# EAGLE design F767ZI NEW (EAGLE 9.6.2)
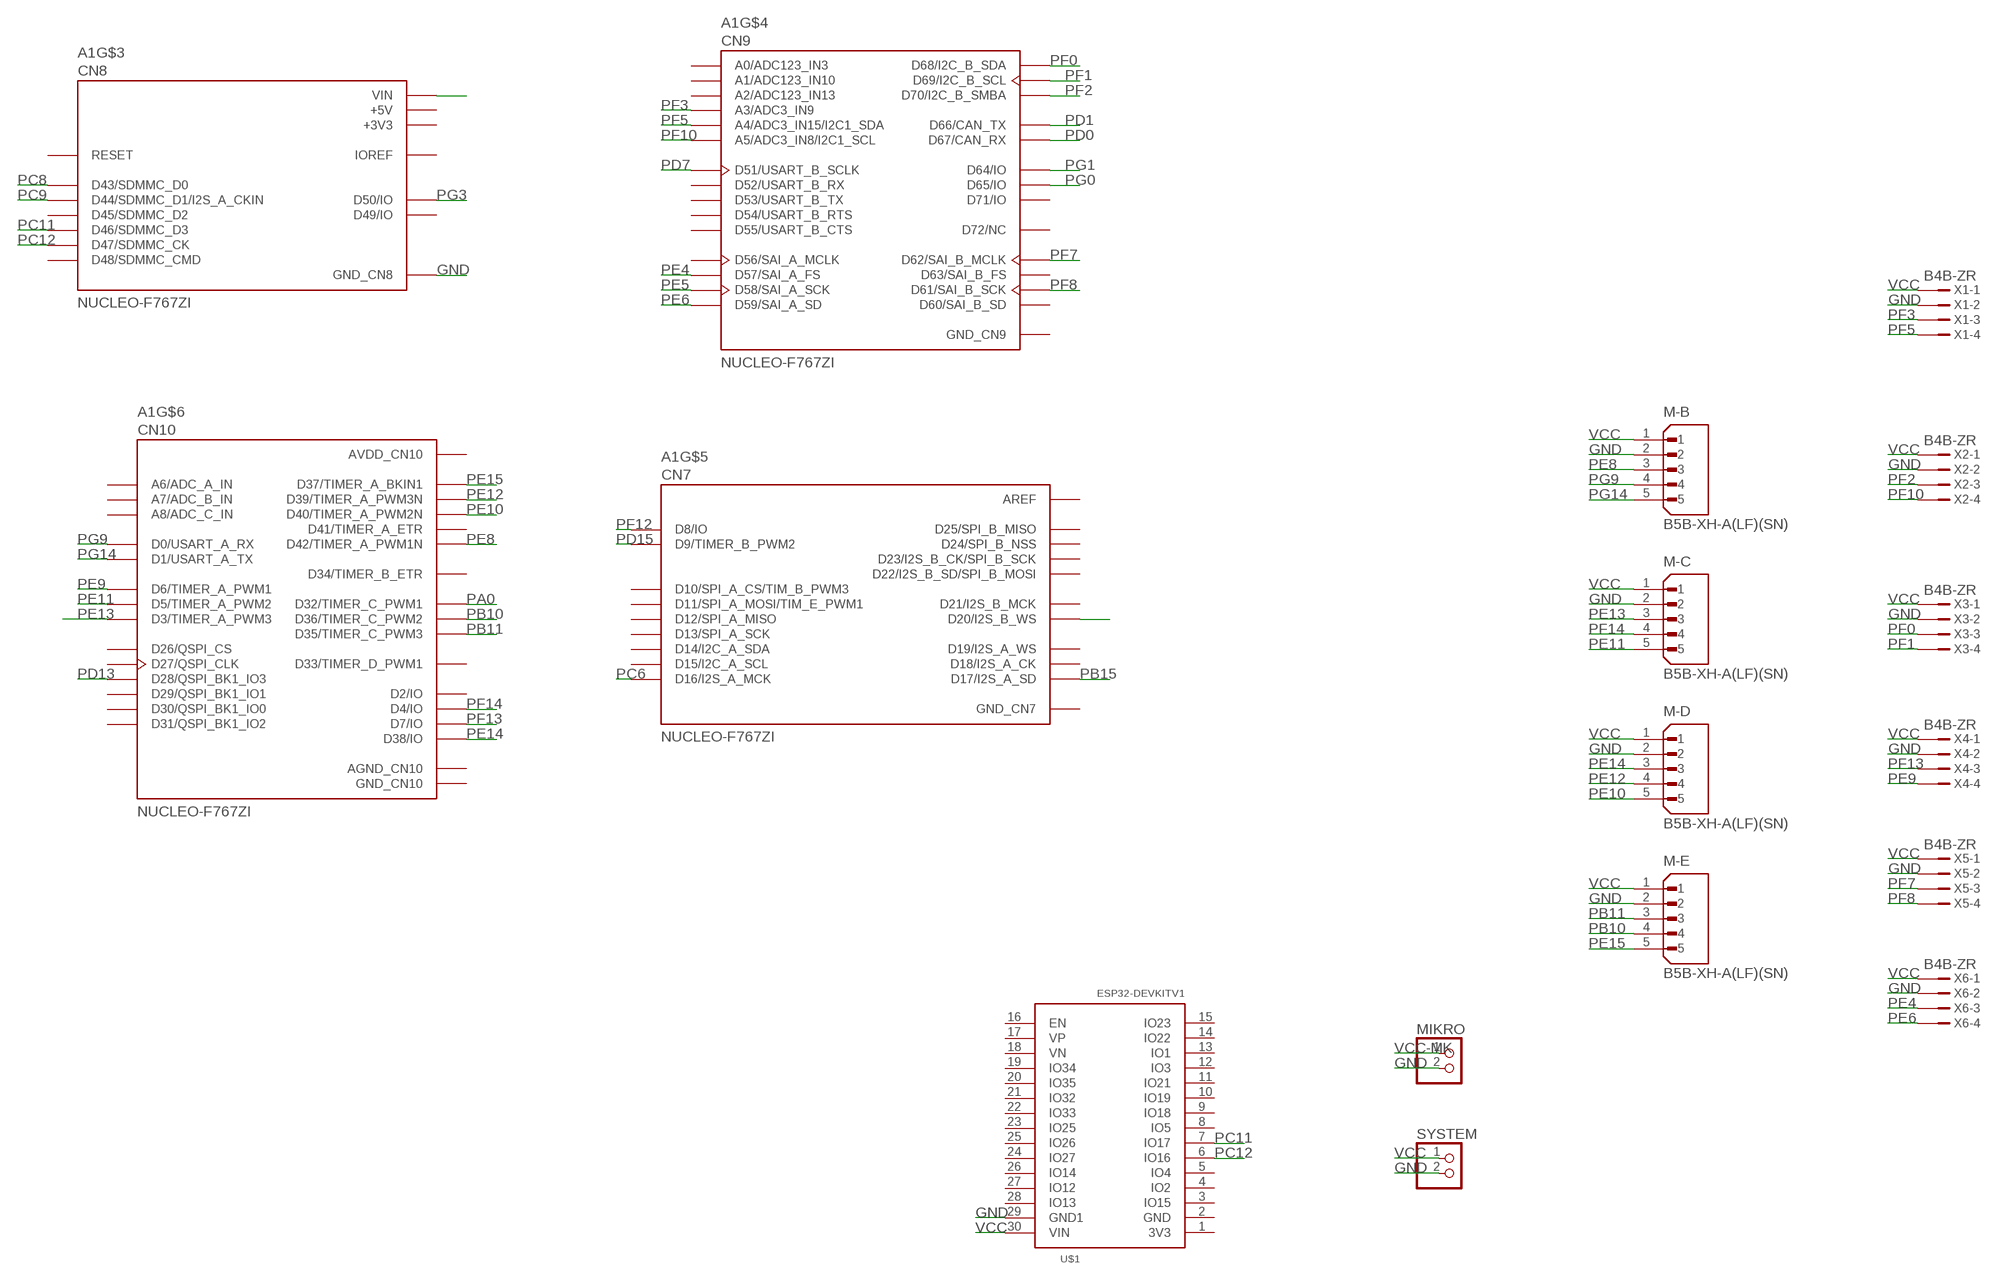
[diagram p0: schematic, sheet 1]

## Parts
A1  NUCLEO-F767ZI  [ST_NUCLEO-F767ZI]
M-B  B5B-XH-A(LF)(SN)  [JST_B5B-XH-A(LF)(SN)]
M-C  B5B-XH-A(LF)(SN)  [JST_B5B-XH-A(LF)(SN)]
M-D  B5B-XH-A(LF)(SN)  [JST_B5B-XH-A(LF)(SN)]
M-E  B5B-XH-A(LF)(SN)  [JST_B5B-XH-A(LF)(SN)]
MIKRO  PINHD-1X2  [1X02]
SYSTEM  PINHD-1X2  [1X02]
U$1  ESP32DEVKITV1  [ESP32-DEVKITV1]
X1  B4B-ZR  [B4B-ZR]
X2  B4B-ZR  [B4B-ZR]
X3  B4B-ZR  [B4B-ZR]
X4  B4B-ZR  [B4B-ZR]
X5  B4B-ZR  [B4B-ZR]
X6  B4B-ZR  [B4B-ZR]

## Nets
GND: A1.CN8_11(GND_CN8) A1.CN8_13(GND_CN8) M-B.2 M-C.2 M-D.2 M-E.2 MIKRO.2 SYSTEM.2 U$1.29(GND1) X1.2 X2.2 X3.2 X4.2 X5.2 X6.2
PA0: A1.CN10_29(D32/TIMER_C_PWM1)
PA15: A1.CN7_9(D20/I2S_B_WS)
PB10: A1.CN10_32(D36/TIMER_C_PWM2) M-E.4
PB11: A1.CN10_34(D35/TIMER_C_PWM3) M-E.3
PB15: A1.CN7_3(D17/I2S_A_SD)
PC6: A1.CN7_1(D16/I2S_A_MCK)
PC8: A1.CN8_2(D43/SDMMC_D0)
PC9: A1.CN8_4(D44/SDMMC_D1/I2S_A_CKIN)
PC11: A1.CN8_8(D46/SDMMC_D3) U$1.7(IO17)
PC12: A1.CN8_10(D47/SDMMC_CK) U$1.6(IO16)
PD0: A1.CN9_25(D67/CAN_RX)
PD1: A1.CN9_27(D66/CAN_TX)
PD7: A1.CN9_2(D51/USART_B_SCLK)
PD13: A1.CN10_19(D28/QSPI_BK1_IO3)
PD15: A1.CN7_18(D9/TIMER_B_PWM2)
PE4: A1.CN9_16(D57/SAI_A_FS) X6.3
PE5: A1.CN9_18(D58/SAI_A_SCK)
PE6: A1.CN9_20(D59/SAI_A_SD) X6.4
PE8: A1.CN10_18(D42/TIMER_A_PWM1N) M-B.3
PE9: A1.CN10_4(D6/TIMER_A_PWM1) X4.4
PE10: A1.CN10_24(D40/TIMER_A_PWM2N) M-D.5
PE11: A1.CN10_6(D5/TIMER_A_PWM2) M-C.5
PE12: A1.CN10_26(D39/TIMER_A_PWM3N) M-D.4
PE13: A1.CN10_10(D3/TIMER_A_PWM3) M-C.3
PE14: A1.CN10_28(D38/IO) M-D.3
PE15: A1.CN10_30(D37/TIMER_A_BKIN1) M-E.5
PF0: A1.CN9_21(D68/I2C_B_SDA) X3.3
PF1: A1.CN9_19(D69/I2C_B_SCL) X3.4
PF2: A1.CN9_17(D70/I2C_B_SMBA) X2.3
PF3: A1.CN9_7(A3/ADC3_IN9) X1.3
PF5: A1.CN9_9(A4/ADC3_IN15/I2C1_SDA) X1.4
PF7: A1.CN9_26(D62/SAI_B_MCLK) X5.3
PF8: A1.CN9_24(D61/SAI_B_SCK) X5.4
PF10: A1.CN9_11(A5/ADC3_IN8/I2C1_SCL) X2.4
PF12: A1.CN7_20(D8/IO)
PF13: A1.CN10_2(D7/IO) X4.3
PF14: A1.CN10_8(D4/IO) M-C.4
PG0: A1.CN9_29(D65/IO)
PG1: A1.CN9_30(D64/IO)
PG3: A1.CN8_16(D50/IO)
PG9: A1.CN10_16(D0/USART_A_RX) M-B.4
PG14: A1.CN10_14(D1/USART_A_TX) M-B.5
VCC: M-B.1 M-C.1 M-D.1 M-E.1 SYSTEM.1 U$1.30(VIN) X1.1 X2.1 X3.1 X4.1 X5.1 X6.1
VCC-MK: A1.CN8_15(VIN) MIKRO.1
Unconnected: A1.CN7_2(D15/I2C_A_SCL) A1.CN7_4(D14/I2C_A_SDA) A1.CN7_5(D18/I2S_A_CK) A1.CN7_7(D19/I2S_A_WS) A1.CN7_10(D13/SPI_A_SCK) A1.CN7_11(D21/I2S_B_MCK) A1.CN7_12(D12/SPI_A_MISO) A1.CN7_13(D22/I2S_B_SD/SPI_B_MOSI) A1.CN7_14(D11/SPI_A_MOSI/TIM_E_PWM1) A1.CN7_15(D23/I2S_B_CK/SPI_B_SCK) A1.CN7_16(D10/SPI_A_CS/TIM_B_PWM3) A1.CN7_17(D24/SPI_B_NSS) A1.CN7_19(D25/SPI_B_MISO) A1.CN8_3(IOREF) A1.CN8_5(RESET) A1.CN8_6(D45/SDMMC_D2) A1.CN8_12(D48/SDMMC_CMD) A1.CN8_14(D49/IO) A1.CN9_1(A0/ADC123_IN3) A1.CN9_3(A1/ADC123_IN10) A1.CN9_4(D52/USART_B_RX) A1.CN9_5(A2/ADC123_IN13) A1.CN9_6(D53/USART_B_TX) A1.CN9_8(D54/USART_B_RTS) A1.CN9_10(D55/USART_B_CTS) A1.CN9_13(D72/NC) A1.CN9_14(D56/SAI_A_MCLK) A1.CN9_15(D71/IO) A1.CN9_22(D60/SAI_B_SD) A1.CN9_28(D63/SAI_B_FS) A1.CN10_7(A6/ADC_A_IN) A1.CN10_9(A7/ADC_B_IN) A1.CN10_11(A8/ADC_C_IN) A1.CN10_12(D2/IO) A1.CN10_13(D26/QSPI_CS) A1.CN10_15(D27/QSPI_CLK) A1.CN10_20(D41/TIMER_A_ETR) A1.CN10_21(D29/QSPI_BK1_IO1) A1.CN10_23(D30/QSPI_BK1_IO0) A1.CN10_25(D31/QSPI_BK1_IO2) A1.CN10_31(D33/TIMER_D_PWM1) A1.CN10_33(D34/TIMER_B_ETR) U$1.1(3V3) U$1.2(GND) U$1.3(IO15) U$1.4(IO2) U$1.5(IO4) U$1.8(IO5) U$1.9(IO18) U$1.10(IO19) U$1.11(IO21) U$1.12(IO3) U$1.13(IO1) U$1.14(IO22) U$1.15(IO23) U$1.16(EN) U$1.17(VP) U$1.18(VN) U$1.19(IO34) U$1.20(IO35) U$1.21(IO32) U$1.22(IO33) U$1.23(IO25) U$1.24(IO27) U$1.25(IO26) U$1.26(IO14) U$1.27(IO12) U$1.28(IO13)

## Power pins joined to a net without a drawn wire
+3V3: A1.CN8_7(+3V3)
+5V: A1.CN8_9(+5V)
AGND_CN10: A1.CN10_3(AGND_CN10)
AREF: A1.CN7_6(AREF)
AVDD_CN10: A1.CN10_1(AVDD_CN10)
GND_CN7: A1.CN7_8(GND_CN7)
GND_CN9: A1.CN9_12(GND_CN9) A1.CN9_23(GND_CN9)
GND_CN10: A1.CN10_5(GND_CN10) A1.CN10_17(GND_CN10) A1.CN10_22(GND_CN10) A1.CN10_27(GND_CN10)

## Library data of the parts
A1 = NUCLEO-F767ZI_no 11 12:NUCLEO-F767ZI: STM32 Nucleo-144 development board with STM32F767ZI MCU, supports Arduino, ST Zio and morpho connectivity Check availability <https://pricing.snapeda.com/parts/NUCLEO-F767ZI/STMicroelectronics/view-part?ref=eda>; AVAILABILITY: In Stock; DESCRIPTION: STM32F767, mbed-Enabled Development Nucleo-144 STM32F7 ARM® Cortex®-M7 MCU 32-Bit Embedded Evaluation Board; MF: STMicroelectronics; MP: NUCLEO-F767ZI; PACKAGE: None; PRICE: None; PURCHASE-URL: https://pricing.snapeda.com/search/part/NUCLEO-F767ZI/?ref=eda
M-B M-C M-D M-E = B5B-XH-A_LF__SN_:B5B-XH-A(LF)(SN): Check availability <https://pricing.snapeda.com/parts/B5B-XH-A%28LF%29%28SN%29/JST%20Sales%20America%20Inc./view-part?ref=eda>; AVAILABILITY: In Stock; DESCRIPTION: Connector Header Through Hole 5 position 0.098 (2.50mm); MF: JST Sales America Inc.; MP: B5B-XH-A(LF)(SN); PACKAGE: None; PRICE: None; PURCHASE-URL: https://pricing.snapeda.com/search/part/B5B-XH-A(LF)(SN)/?ref=eda
MIKRO SYSTEM = pinhead:PINHD-1X2: PIN HEADER
U$1 = ESP32-DEVKITV1:ESP32DEVKITV1
X1-X6 = con-jst:?4B-ZR: ZH CONNECTOR 1.5 mm, 4 pin 1 row Source: http://www.jst.com .. eZH.pdf; MF: FARNELL; MPN: B4B-ZR(LF)(SN); OC_FARNELL: 1830916; OC_NEWARK: 37K9960

## Board
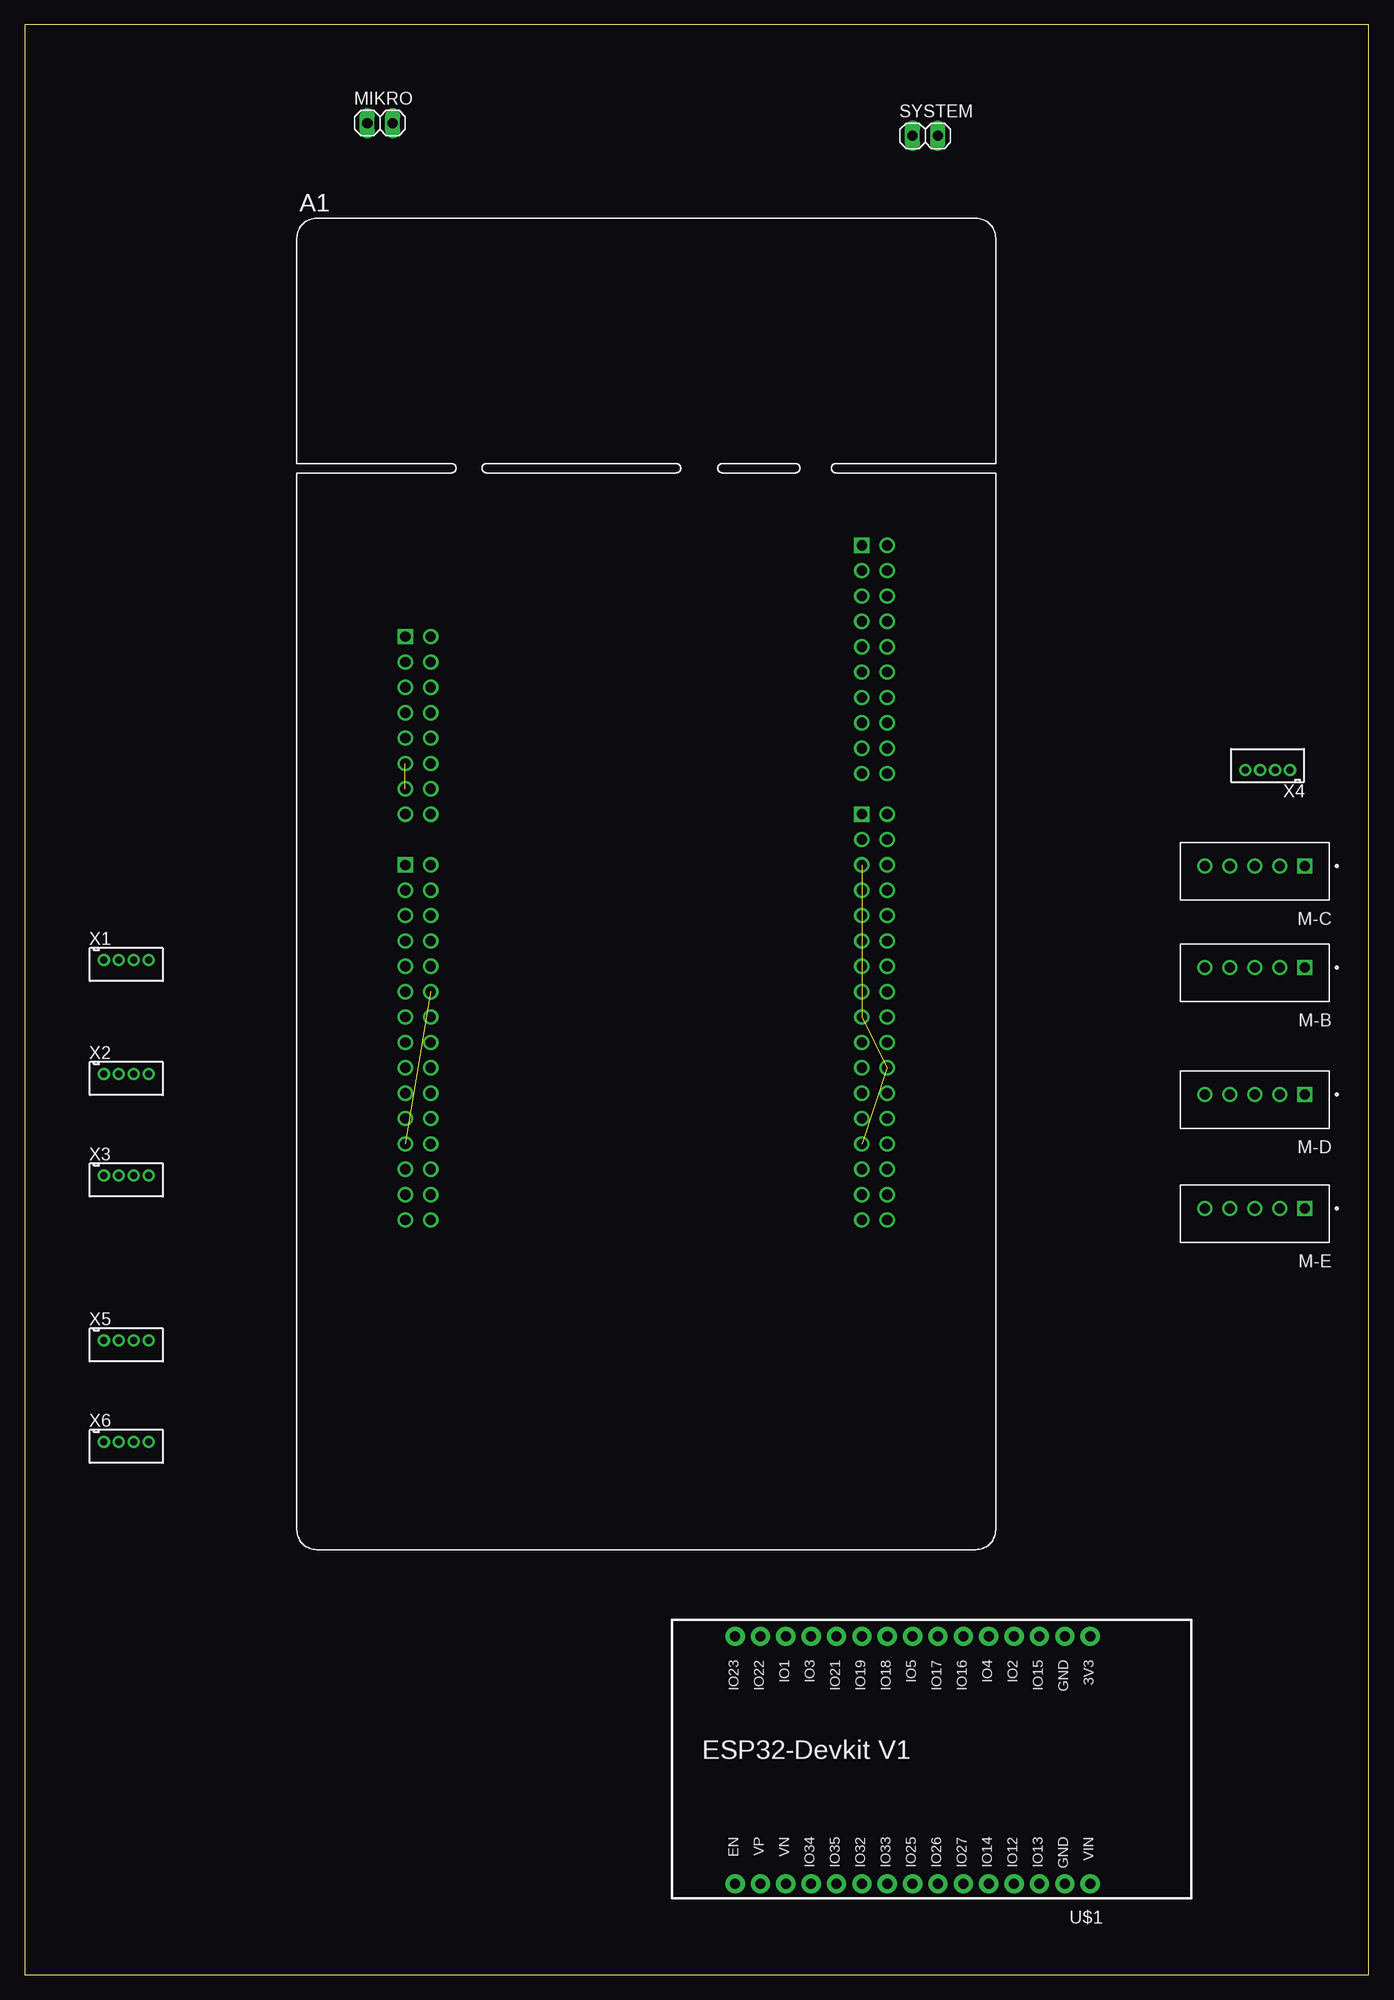
[diagram p1: board, top side]
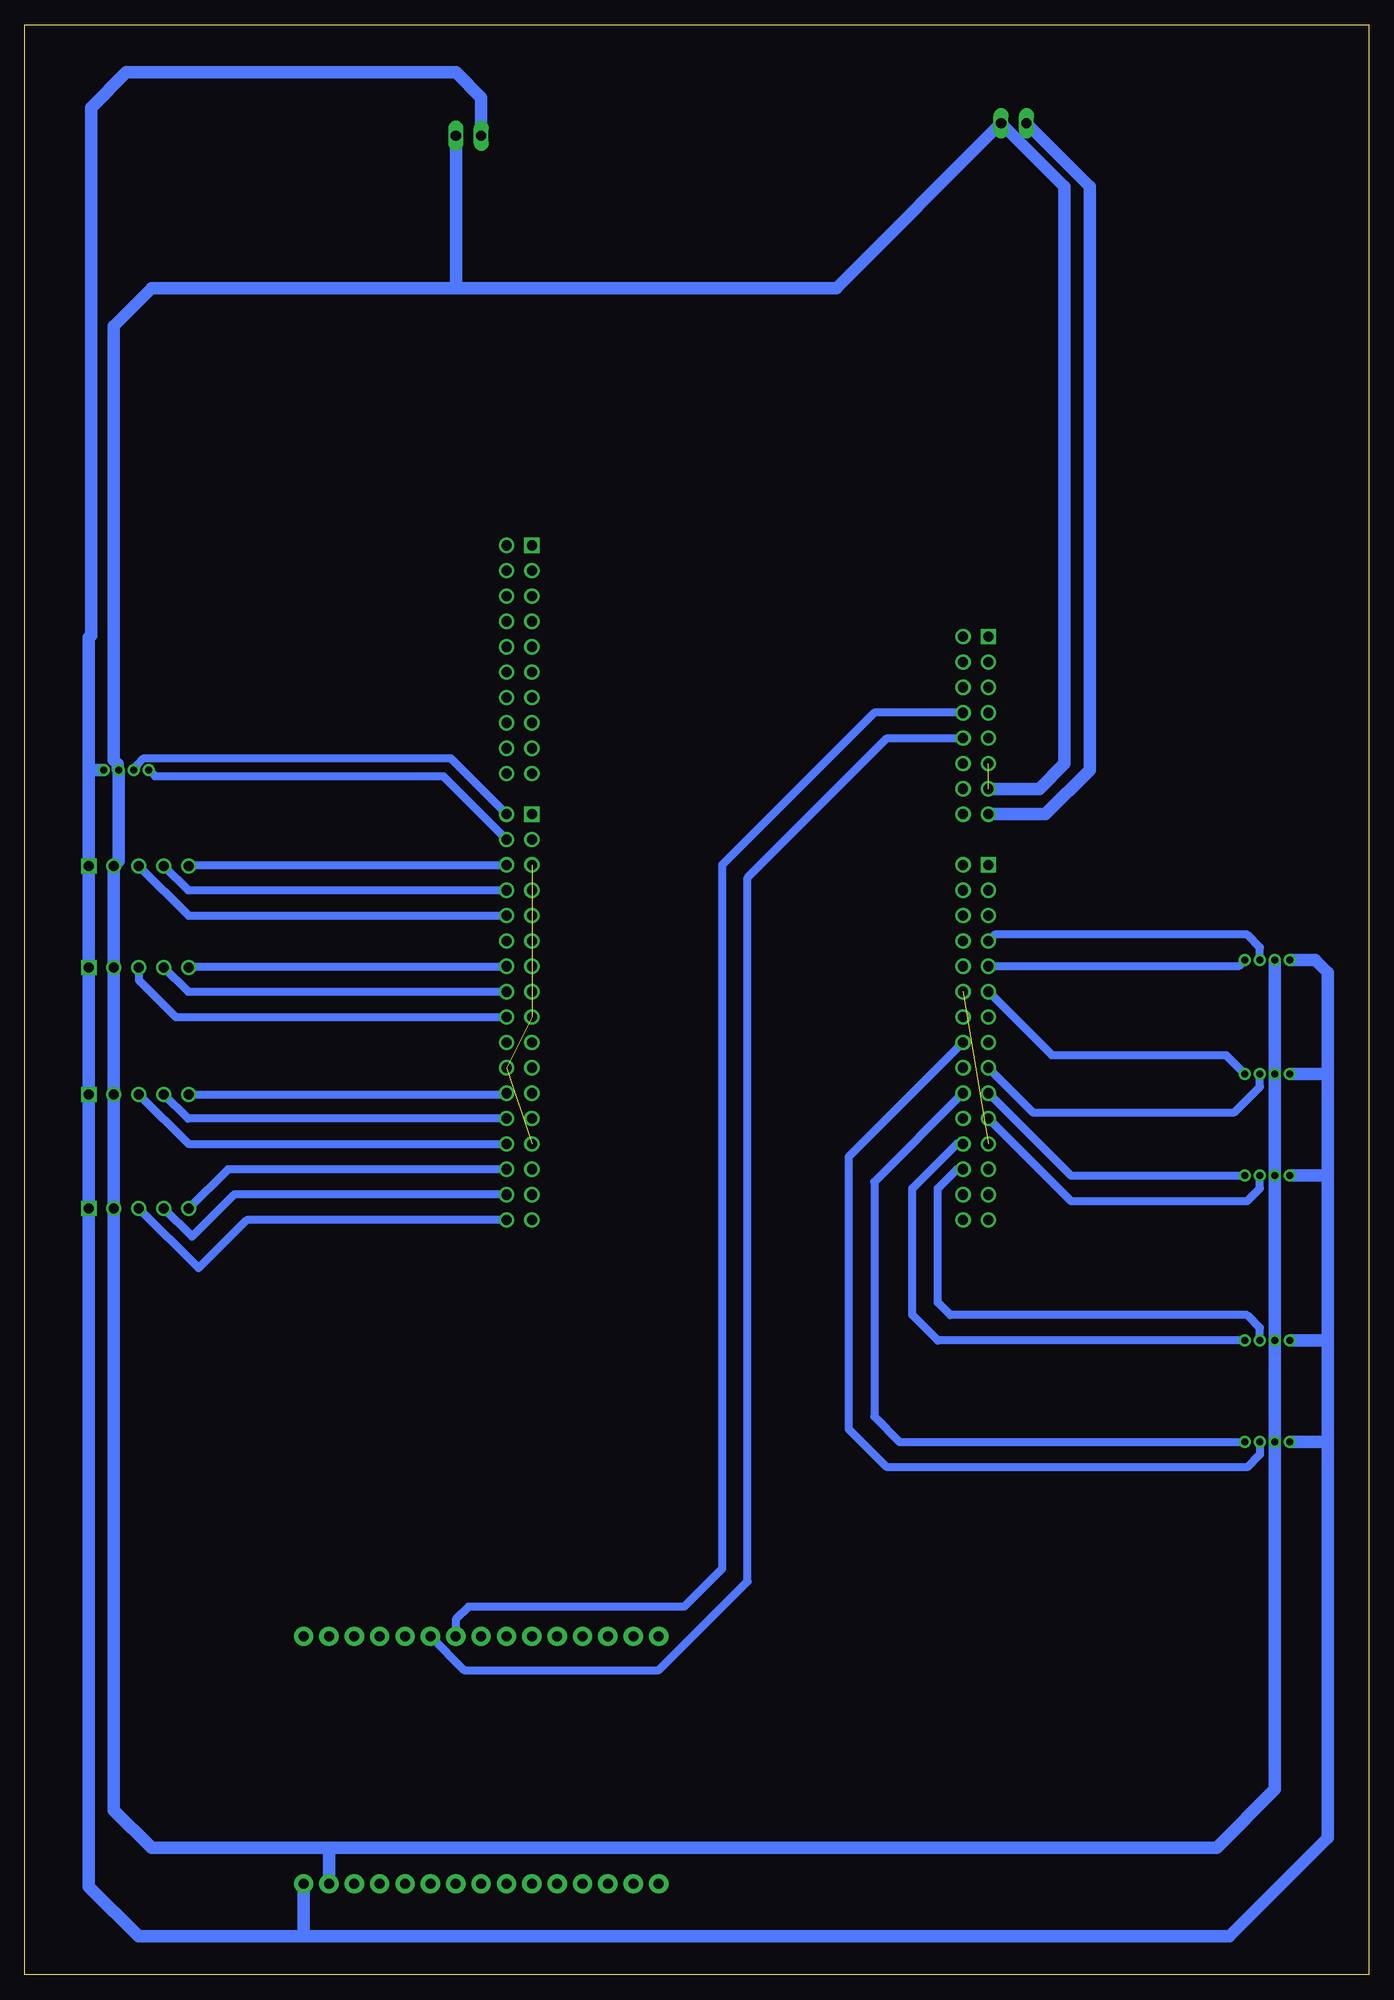
[diagram p2: board, bottom side, seen from below]

Size 134.6 x 195.25 mm. Coordinates in mm from the lower left corner, seen from the top.
Outline: 0,0 134.6,0 134.6,195.25 0,195.25 0,0
Copper layers (1*16): Top 0.035mm / dielectric 1.5mm / Bottom 0.035mm
Design rules "default": minimum track width 6mil, minimum drill 0.35mm, track to track 6mil, track to pad 6mil, pad to pad 6mil, via to via 6mil, smd to smd 6mil, copper to edge 40mil, drill to drill 6mil, minimum pad ring 10mil, minimum via ring 8mil, stop-mask expansion 4mil, vias tented up to drill 0mil, thermal gap 10mil

### Footprints (pad centres in the part's own frame; a part is rotated, then mirrored left to right if it is on the bottom)
ST_NUCLEO-F767ZI = drill 1.02 square: CN7_1 21.59,33.914; CN8_1 -24.13,24.77; CN9_1 -24.13,1.91; CN10_1 21.59,6.99 | drill 1.02: CN7_2 24.13,33.914; CN7_3 21.59,31.374; CN7_4 24.13,31.374; CN7_5 21.59,28.834; CN7_6 24.13,28.834; CN7_7 21.59,26.294; CN7_8 24.13,26.294; CN7_9 21.59,23.754; CN7_10 24.13,23.754; CN7_11 21.59,21.214; CN7_12 24.13,21.214; CN7_13 21.59,18.674; CN7_14 24.13,18.674; CN7_15 21.59,16.134; CN7_16 24.13,16.134; CN7_17 21.59,13.594; CN7_18 24.13,13.594; CN7_19 21.59,11.054; CN7_20 24.13,11.054; CN8_2 -21.59,24.77; CN8_3 -24.13,22.23; CN8_4 -21.59,22.23; CN8_5 -24.13,19.69; CN8_6 -21.59,19.69; CN8_7 -24.13,17.15; CN8_8 -21.59,17.15; CN8_9 -24.13,14.61; CN8_10 -21.59,14.61; CN8_11 -24.13,12.07; CN8_12 -21.59,12.07; CN8_13 -24.13,9.53; CN8_14 -21.59,9.53; CN8_15 -24.13,6.99; CN8_16 -21.59,6.99; CN9_2 -21.59,1.91; CN9_3 -24.13,-0.63; CN9_4 -21.59,-0.63; CN9_5 -24.13,-3.17; CN9_6 -21.59,-3.17; CN9_7 -24.13,-5.71; CN9_8 -21.59,-5.71; CN9_9 -24.13,-8.25; CN9_10 -21.59,-8.25; CN9_11 -24.13,-10.79; CN9_12 -21.59,-10.79; CN9_13 -24.13,-13.33; CN9_14 -21.59,-13.33; CN9_15 -24.13,-15.87; CN9_16 -21.59,-15.87; CN9_17 -24.13,-18.41; CN9_18 -21.59,-18.41; CN9_19 -24.13,-20.95; CN9_20 -21.59,-20.95; CN9_21 -24.13,-23.49; CN9_22 -21.59,-23.49; CN9_23 -24.13,-26.03; CN9_24 -21.59,-26.03; CN9_25 -24.13,-28.57; CN9_26 -21.59,-28.57; CN9_27 -24.13,-31.11; CN9_28 -21.59,-31.11; CN9_29 -24.13,-33.65; CN9_30 -21.59,-33.65; CN10_2 24.13,6.99; CN10_3 21.59,4.45; CN10_4 24.13,4.45; CN10_5 21.59,1.91; CN10_6 24.13,1.91; CN10_7 21.59,-0.63; CN10_8 24.13,-0.63; CN10_9 21.59,-3.17; CN10_10 24.13,-3.17; CN10_11 21.59,-5.71; CN10_12 24.13,-5.71; CN10_13 21.59,-8.25; CN10_14 24.13,-8.25; CN10_15 21.59,-10.79; CN10_16 24.13,-10.79; CN10_17 21.59,-13.33; CN10_18 24.13,-13.33; CN10_19 21.59,-15.87; CN10_20 24.13,-15.87; CN10_21 21.59,-18.41; CN10_22 24.13,-18.41; CN10_23 21.59,-20.95; CN10_24 24.13,-20.95; CN10_25 21.59,-23.49; CN10_26 24.13,-23.49; CN10_27 21.59,-26.03; CN10_28 24.13,-26.03; CN10_29 21.59,-28.57; CN10_30 24.13,-28.57; CN10_31 21.59,-31.11; CN10_32 24.13,-31.11; CN10_33 21.59,-33.65; CN10_34 24.13,-33.65
JST_B5B-XH-A(LF)(SN) = drill 1 square: 1 -5,-0.525 | drill 1: 2 -2.5,-0.525; 3 0,-0.525; 4 2.5,-0.525; 5 5,-0.525
1X02 = drill 1.016 long: 1 -1.27,0; 2 1.27,0
ESP32-DEVKITV1 = drill 1 pad 1.93: 1 -22.87,-13.54; 2 -20.33,-13.54; 3 -17.79,-13.54; 4 -15.25,-13.54; 5 -12.71,-13.54; 6 -10.17,-13.54; 7 -7.63,-13.54; 8 -5.09,-13.54; 9 -2.55,-13.54; 10 -0.01,-13.54; 11 2.53,-13.54; 12 5.07,-13.54; 13 7.61,-13.54; 14 10.15,-13.54; 15 12.69,-13.54; 16 12.69,11.23; 17 10.15,11.23; 18 7.61,11.23; 19 5.07,11.23; 20 2.53,11.23; 21 -0.01,11.23; 22 -2.55,11.23; 23 -5.09,11.23; 24 -7.63,11.23; 25 -10.17,11.23; 26 -12.71,11.23; 27 -15.25,11.23; 28 -17.79,11.23; 29 -20.33,11.23; 30 -22.87,11.23
B4B-ZR = drill 0.7 pad 1.1: 1 -2.25,0; 2 -0.75,0; 3 0.75,0; 4 2.25,0

### Placement (x,y rotation side)
A1  62.23,109.22 0 top
M-B  123.19,100.33 180 top
M-C  123.19,110.49 180 top
M-D  123.19,87.63 180 top
M-E  123.19,76.2 180 top
MIKRO  35.56,185.42 0 top
SYSTEM  90.17,184.15 0 top
U$1  83.82,20.32 180 top
X1  10.16,101.6 0 top
X2  10.16,90.17 0 top
X3  10.16,80.01 0 top
X4  124.46,120.65 180 top
X5  10.16,63.5 0 top
X6  10.16,53.34 0 top

### Tracks (layer width: path | path; a pad name or v marks a point on that pad's centre or on a via)
GND  (1 unrouted)
  Bottom 1.27: A1.CN8_13 33.02,118.75 30.48,121.29 30.48,179.07 MIKRO.2 53.34,168.91 91.44,168.91 | 104.14,12.7 121.92,12.7 125.69,16.47 M-E.2 M-D.2 M-B.2 M-C.2 125.21,111.5 X4.2 125.29,120.73 125.29,121.24 125.69,121.64 125.69,133.88 125.73,133.91 125.73,165.1 121.92,168.91 91.44,168.91 | U$1.29 104.14,12.7 | X1.2 X2.2 X3.2 X5.2 X6.2 9.41,18.53 15.24,12.7 104.14,12.7 | SYSTEM.2 91.44,168.91
GND_CN9  (1 unrouted)
GND_CN10  (3 unrouted)
PB10
  Bottom 0.813: A1.CN10_32 113.66,78.11 117.87,73.9 M-E.4
PB11
  Bottom 0.813: A1.CN10_34 112.39,75.57 117.21,70.75 M-E.3
PC11
  Bottom 0.813: A1.CN8_8 49.53,126.37 64.77,111.13 64.77,40.64 68.58,36.83 90.17,36.83 91.45,35.55 U$1.7
PC12
  Bottom 0.813: U$1.6 90.61,30.48 71.12,30.48 62.23,39.37 62.23,109.86 48.26,123.83 A1.CN8_10
PE4
  Bottom 0.813: X6.3 10.91,52.07 12.18,50.8 48.26,50.8 52.07,54.61 52.07,81.92 A1.CN9_16
PE6
  Bottom 0.813: A1.CN9_20 49.53,79.38 49.53,55.88 46.99,53.34 X6.4
PE8
  Bottom 0.813: M-B.3 123.19,99.58 119.49,95.89 A1.CN10_18
PE9
  Bottom 0.813: A1.CN10_4 92.71,120.02 121.58,120.02 X4.4
PE10
  Bottom 0.813: M-D.5 86.48,88.16 A1.CN10_24
PE11
  Bottom 0.813: M-C.5 118.08,111.13 A1.CN10_6
PE12
  Bottom 0.813: A1.CN10_26 118.27,85.73 M-D.4
PE13
  Bottom 0.813: M-C.3 118.23,106.05 A1.CN10_10
PE14
  Bottom 0.813: M-D.3 118.23,83.19 A1.CN10_28
PE15
  Bottom 0.813: M-E.5 114.27,80.65 A1.CN10_30
PF0
  Bottom 0.813: A1.CN9_21 29.84,77.47 12.18,77.47 10.91,78.74 X3.3
PF1
  Bottom 0.813: A1.CN9_19 29.84,80.01 X3.4
PF2
  Bottom 0.813: A1.CN9_17 33.65,86.36 13.45,86.36 10.91,88.9 X2.3
PF3
  Bottom 0.813: A1.CN9_7 37.47,104.14 12.18,104.14 10.91,102.87 X1.3
PF5
  Bottom 0.813: X1.4 13.04,100.97 A1.CN9_9
PF7
  Bottom 0.813: X5.3 10.91,64.77 12.18,66.04 41.91,66.04 43.18,67.31 43.18,78.74 41.27,80.65 A1.CN9_26
PF8
  Bottom 0.813: X5.4 43.18,63.5 45.72,66.04 45.72,78.74 41.27,83.19 A1.CN9_24
PF10
  Bottom 0.813: X2.4 14.32,92.08 31.75,92.08 A1.CN9_11
PF13
  Bottom 0.813: X4.3 123.37,120.99 123.37,121.13 122.69,121.81 91.96,121.81 A1.CN10_2
PF14
  Bottom 0.813: M-C.4 118.27,108.59 A1.CN10_8
PG9
  Bottom 0.813: A1.CN10_16 118.27,98.43 M-B.4
PG14
  Bottom 0.813: M-B.5 118.08,100.97 A1.CN10_14
VCC
  Bottom 1.27: 106.68,3.81 13.97,3.81 4.1,13.68 4.1,53.34 | 106.68,3.81 123.19,3.81 128.19,8.81 M-E.1 M-D.1 M-B.1 M-C.1 128.19,120.65 | 128.19,120.65 128.19,133.88 127.98,134.09 127.98,186.98 124.46,190.5 91.44,190.5 88.9,187.96 SYSTEM.1 | X4.1 128.19,120.65 | 106.68,3.81 U$1.30 | X1.1 5.37,101.6 4.1,100.33 4.1,90.17 | 4.1,90.17 4.1,80.01 | 4.1,90.17 X2.1 | 4.1,80.01 X3.1 | 4.1,80.01 4.1,63.5 | 4.1,63.5 4.1,53.34 | X5.1 4.1,63.5 | X6.1 4.1,53.34
VCC-MK
  Bottom 1.27: MIKRO.1 27.94,179.07 27.94,120.65 32.38,116.21 A1.CN8_15